# Altium schematic sheet Microcontroller.SchDoc
size A; SheetNumber: 6; SheetTotal: 7
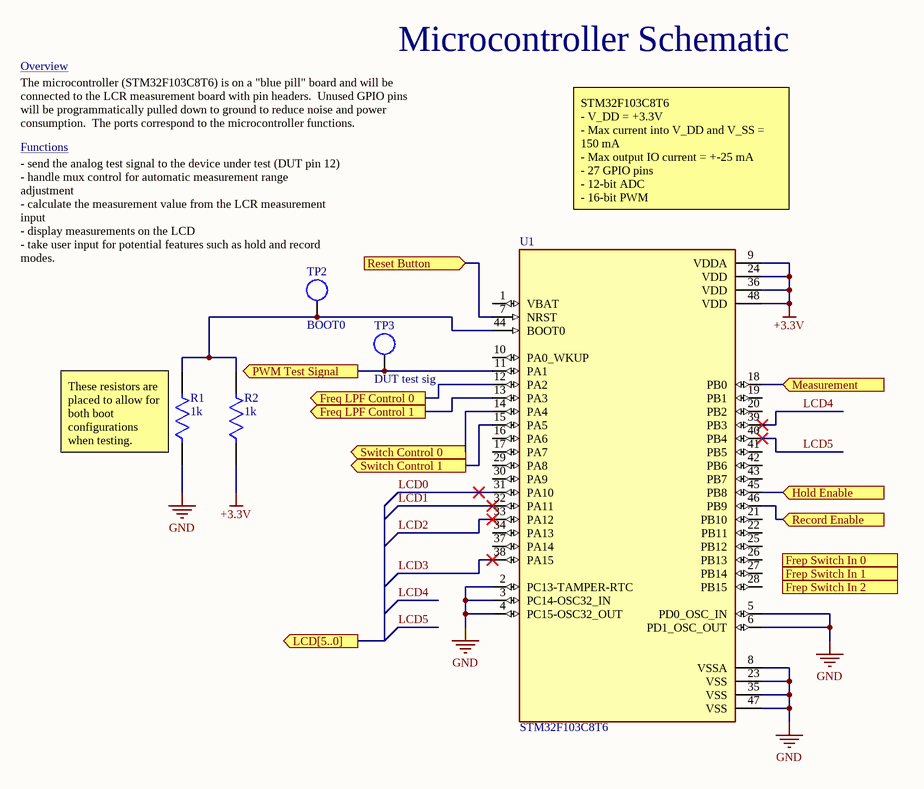
[diagram p0: Microcontroller.SchDoc]

## Parts
R1  1k  [FP-RNCP0805-MFG]
R2  1k  [FP-RNCP0805-MFG]
TP2  BOOT0  [PCBComponent_1]
TP3  DUT test sig  [PCBComponent_1]
U1  STM32F103C8T6  [QFP50P900X900X160-48N]

## Ports
Frep Switch In 0 (in), Frep Switch In 1 (in), Frep Switch In 2 (in), Freq LPF Control 0 (out), Freq LPF Control 1 (out), Hold Enable (in), LCD[5..0] (out), Measurement (in), PWM Test Signal (out), Record Enable (in), Reset Button (in), Switch Control 0 (out), Switch Control 1 (out)

## Nets
+3.3V: R2.1 U1.9(VDDA) U1.24(VDD) U1.36(VDD) U1.48(VDD)
GND: R1.1 U1.2(PC13-TAMPER-RTC) U1.3(PC14-OSC32_IN) U1.4(PC15-OSC32_OUT) U1.5(PD0_OSC_IN) U1.6(PD1_OSC_OUT) U1.8(VSSA) U1.23(VSS) U1.35(VSS) U1.47(VSS)
Freq LPF Control 0: U1.12(PA2) ; port Freq LPF Control 0
Freq LPF Control 1: U1.13(PA3) ; port Freq LPF Control 1
Hold Enable: U1.45(PB8) ; port Hold Enable
LCD0: U1.31(PA10)
LCD1: U1.32(PA11)
LCD2: U1.33(PA12)
LCD3: U1.38(PA15)
LCD4: U1.39(PB3)
LCD5: U1.40(PB4)
Measurement: U1.18(PB0) ; port Measurement
PWM Test Signal: TP3.TP U1.11(PA1) ; port PWM Test Signal
Record Enable: U1.46(PB9) ; port Record Enable
Reset Button: U1.7(NRST) ; port Reset Button
Switch Control 0: U1.14(PA4) ; port Switch Control 0
Switch Control 1: U1.15(PA5) ; port Switch Control 1
NetR1_2: R1.2 R2.2 TP2.TP U1.44(BOOT0)

Not connected (* = marked no-connect by the designer): U1 1(VBAT) 10(PA0_WKUP) 16(PA6) 17(PA7) 19(PB1) 20(PB2) 21(PB10) 22(PB11) 25(PB12) 26(PB13) 27(PB14) 28(PB15) 29(PA8) 30(PA9) 34(PA13) 37(PA14) 41(PB5) 42(PB6) 43(PB7)

## Notes on the sheet
- Overview
- Microcontroller Schematic
- The microcontroller (STM32F103C8T6) is on a "blue pill" board and will be connected to the LCR measurement board with pin headers.  Unused GPIO pins will be programmatically pulled down to ground to reduce noise and power consumption.  The ports correspond to the microcontroller functions.
- Functions
- STM32F103C8T6
  - V_DD = +3.3V
  - Max current into V_DD and V_SS = 150 mA
  - Max output IO current = +-25 mA
  - 27 GPIO pins
  - 12-bit ADC
  - 16-bit PWM
- (near TP2) - send the analog test signal to the device under test (DUT pin 12)
  - handle mux control for automatic measurement range adjustment
  - calculate the measurement value from the LCR measurement input
  - display measurements on the LCD
  - take user input for potential features such as hold and record modes.
- (near R1) These resistors are placed to allow for both boot configurations when testing.

## Library data of the parts
R1 R2 = CMP-26527-001902-1: 1kΩ ±1% 0.25W 0805 High Power Anti-Sulfur Thin Film Chip Resistor; Resistance: 1kR; Power Rating: 250mW; Temperature Coefficient: 100ppm/°C; Series: RNCP; RoHS Compliant: Yes; Case Code (Metric): 2012; Length: 0.079inch; Case/Package: 0805; Max Power Dissipation: 250mW; Height: 0.024inch; Size Code: 0805; Max Operating Temperature: 155°C; Tolerance: 1%; Min Operating Temperature: -55°C; Width: 0.049inch; Case Code (Imperial): 0805; Packaging: Tape and Reel; Mount: Surface Mount; Features: Moisture Resistant; Lead Free: Lead Free; Resistor Type: Thin Film; Number of Terminations: 2
TP2 TP3 = Component_1
U1 = STM32F103C8T6: ARMÂ® CortexÂ®-M3 STM32F1 Microcontroller IC 32-Bit 72MHz 64KB _64K x 8_ FLASH; MF: STMicroelectronics; Price: None; Package: LQFP-48 STMicroelectronics; Value: *; MP: STM32F103C8T6; Availability: Unavailable; SnapEDA_Link: https://www.snapeda.com/parts/STM32F103C8T6/STMicroelectronics/view-part/52195/?ref=snap